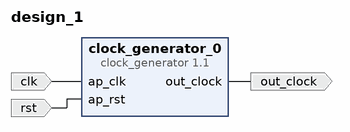
[diagram p0: block diagram of the top level]
# Vivado block design design_1, xc7a35tcpg236-1, Vivado 2019.2
create_bd_design design_1

create_bd_port -dir I -type clk clk
create_bd_port -dir I -type rst rst
set_property -dict {CONFIG.POLARITY ACTIVE_HIGH} [get_bd_ports rst]
create_bd_port -dir O -type data out_clock

create_bd_cell -type ip -vlnv Xilinx:hls:clock_generator:1.1 clock_generator_0

# ---- connections ----

connect_bd_net -net ap_clk_0_1 [get_bd_ports clk] [get_bd_pins clock_generator_0/ap_clk]
connect_bd_net -net ap_rst_0_1 [get_bd_ports rst] [get_bd_pins clock_generator_0/ap_rst]
connect_bd_net [get_bd_pins clock_generator_0/out_clock] [get_bd_ports out_clock]

validate_bd_design
save_bd_design
